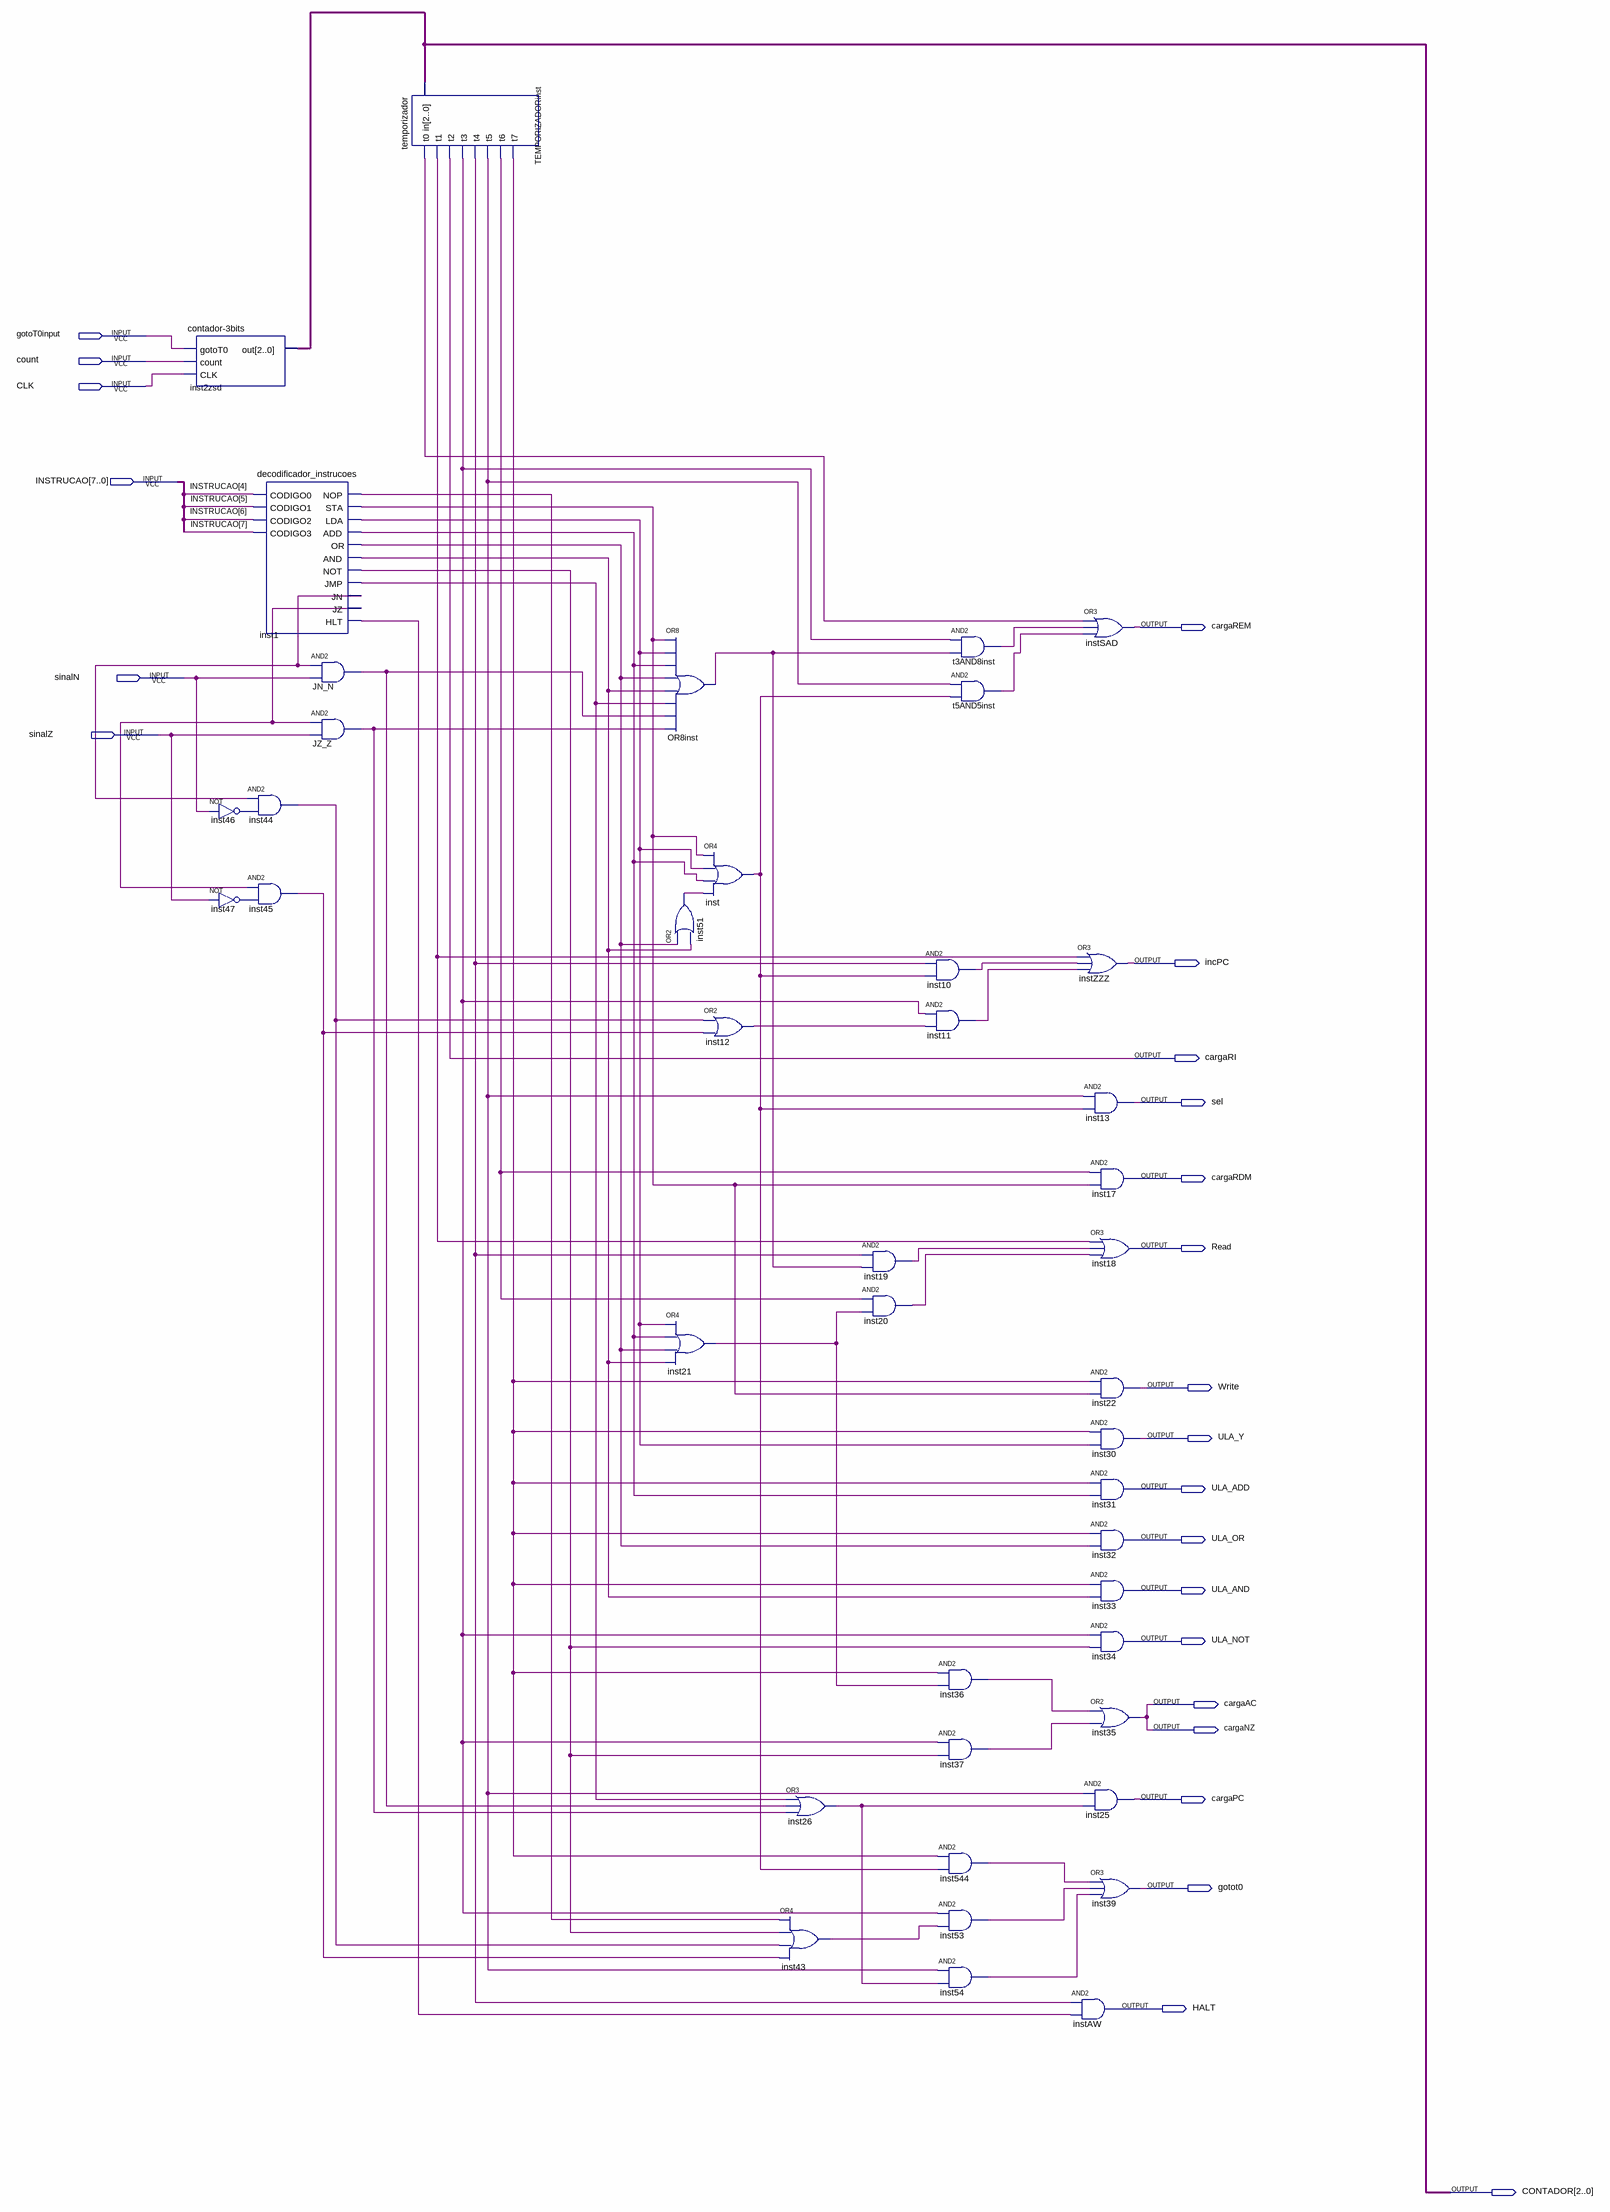
[diagram p0: schematic sheet]
// Quartus schematic unidade_de_controle_neander.bdf as structural Verilog: 42 symbols, 24 pins
module unidade_de_controle_neander (
  input  gotoT0input,
  input  count,
  input  CLK,
  input  [7:0] INSTRUCAO,
  input  sinalN,
  input  sinalZ,
  output cargaREM,
  output incPC,
  output cargaRI,
  output sel,
  output cargaRDM,
  output Read,
  output Write,
  output ULA_Y,
  output ULA_ADD,
  output ULA_OR,
  output ULA_AND,
  output ULA_NOT,
  output cargaAC,
  output cargaNZ,
  output cargaPC,
  output gotot0,
  output HALT,
  output [2:0] CONTADOR
);

  wire inst1_add, inst1_and, inst1_hlt, inst1_jmp, inst1_jn, inst1_jz, inst1_lda, inst1_nop, inst1_not,
       inst1_or, inst1_sta, inst10_out, inst11_out, inst12_out, inst19_out, inst20_out, inst21_out,
       inst26_out, inst36_out, inst37_out, inst43_out, inst44_out, inst45_out, inst46_out, inst47_out,
       inst51_out, inst53_out, inst54_out, inst544_out, inst_out, JN_N_out, JZ_Z_out, OR8inst_out,
       t3AND8inst_out, t5AND5inst_out, TEMPORIZADORinst_t0, TEMPORIZADORinst_t1, TEMPORIZADORinst_t3,
       TEMPORIZADORinst_t4, TEMPORIZADORinst_t5, TEMPORIZADORinst_t6, TEMPORIZADORinst_t7;

  \contador-3bits  inst2zsd (.gotoT0(gotoT0input), .count(count), .CLK(CLK), .out(CONTADOR));
  decodificador_instrucoes inst1 (
    .CODIGO0(INSTRUCAO[4]), .CODIGO1(INSTRUCAO[5]), .CODIGO2(INSTRUCAO[6]), .CODIGO3(INSTRUCAO[7]),
    .NOP(inst1_nop), .STA(inst1_sta), .LDA(inst1_lda), .ADD(inst1_add), .OR(inst1_or), .AND(inst1_and),
    .NOT(inst1_not), .JMP(inst1_jmp), .JN(inst1_jn), .JZ(inst1_jz), .HLT(inst1_hlt));
  and inst44 (inst44_out, inst1_jn, inst46_out);
  not inst46 (inst46_out, sinalN);
  and inst45 (inst45_out, inst1_jz, inst47_out);
  not inst47 (inst47_out, sinalZ);
  and JN_N (JN_N_out, inst1_jn, sinalN);
  and JZ_Z (JZ_Z_out, inst1_jz, sinalZ);
  temporizador TEMPORIZADORinst (
    .in(CONTADOR), .t0(TEMPORIZADORinst_t0), .t1(TEMPORIZADORinst_t1), .t2(cargaRI),
    .t3(TEMPORIZADORinst_t3), .t4(TEMPORIZADORinst_t4), .t5(TEMPORIZADORinst_t5), .t6(TEMPORIZADORinst_t6),
    .t7(TEMPORIZADORinst_t7));
  or OR8inst (OR8inst_out, inst1_sta, inst1_lda, inst1_add, inst1_or, inst1_and, inst1_jmp, JN_N_out, JZ_Z_out);
  or inst (inst_out, inst1_sta, inst1_lda, inst1_add, inst51_out);
  or inst51 (inst51_out, inst1_or, inst1_and);
  or inst12 (inst12_out, inst44_out, inst45_out);
  or inst21 (inst21_out, inst1_lda, inst1_add, inst1_or, inst1_and);
  or inst26 (inst26_out, inst1_jmp, JN_N_out, JZ_Z_out);
  or inst43 (inst43_out, inst1_nop, inst1_not, inst44_out, inst45_out);
  and inst19 (inst19_out, TEMPORIZADORinst_t4, OR8inst_out);
  and inst20 (inst20_out, TEMPORIZADORinst_t6, inst21_out);
  and t3AND8inst (t3AND8inst_out, TEMPORIZADORinst_t3, OR8inst_out);
  and t5AND5inst (t5AND5inst_out, TEMPORIZADORinst_t5, inst_out);
  and inst10 (inst10_out, TEMPORIZADORinst_t4, inst_out);
  and inst11 (inst11_out, TEMPORIZADORinst_t3, inst12_out);
  and inst36 (inst36_out, TEMPORIZADORinst_t7, inst21_out);
  and inst37 (inst37_out, TEMPORIZADORinst_t3, inst1_not);
  and inst544 (inst544_out, TEMPORIZADORinst_t7, inst_out);
  and inst53 (inst53_out, TEMPORIZADORinst_t3, inst43_out);
  and inst54 (inst54_out, TEMPORIZADORinst_t5, inst26_out);
  or instSAD (cargaREM, TEMPORIZADORinst_t0, t3AND8inst_out, t5AND5inst_out);
  or instZZZ (incPC, TEMPORIZADORinst_t1, inst10_out, inst11_out);
  and inst13 (sel, TEMPORIZADORinst_t5, inst_out);
  and inst17 (cargaRDM, TEMPORIZADORinst_t6, inst1_sta);
  or inst18 (Read, TEMPORIZADORinst_t1, inst19_out, inst20_out);
  and inst22 (Write, TEMPORIZADORinst_t7, inst1_sta);
  and inst30 (ULA_Y, TEMPORIZADORinst_t7, inst1_lda);
  and inst31 (ULA_ADD, TEMPORIZADORinst_t7, inst1_add);
  and inst32 (ULA_OR, TEMPORIZADORinst_t7, inst1_or);
  and inst33 (ULA_AND, TEMPORIZADORinst_t7, inst1_and);
  and inst34 (ULA_NOT, TEMPORIZADORinst_t3, inst1_not);
  or inst35 (cargaAC, inst36_out, inst37_out);
  and inst25 (cargaPC, TEMPORIZADORinst_t5, inst26_out);
  or inst39 (gotot0, inst544_out, inst53_out, inst54_out);
  and instAW (HALT, TEMPORIZADORinst_t4, inst1_hlt);

  assign cargaNZ = cargaAC;
endmodule
